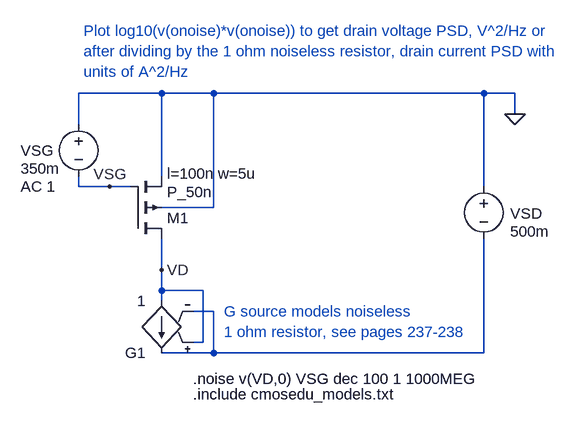
[diagram p0: schematic NOISE_PMOS_50n.asc]
NOISE_PMOS_50n.asc, the LTspice schematic file:
Version 4
SHEET 1 1520 688
WIRE 448 -16 320 -16
WIRE 528 -16 448 -16
WIRE 944 -16 528 -16
WIRE 992 -16 944 -16
WIRE 992 16 992 -16
WIRE 320 32 320 -16
WIRE 448 112 448 -16
WIRE 320 128 320 112
WIRE 368 128 320 128
WIRE 400 128 368 128
WIRE 944 128 944 -16
WIRE 528 160 528 -16
WIRE 528 160 448 160
WIRE 448 256 448 208
WIRE 448 288 448 256
WIRE 512 288 448 288
WIRE 448 304 448 288
WIRE 528 320 496 320
WIRE 512 368 512 288
WIRE 512 368 496 368
WIRE 528 384 528 320
WIRE 528 384 448 384
WIRE 944 384 944 208
WIRE 944 384 528 384
FLAG 992 16 0
FLAG 368 128 VSG
FLAG 448 256 VD
SYMBOL voltage 320 16 R0
WINDOW 0 -89 56 Left 2
WINDOW 3 -89 84 Left 2
WINDOW 123 -89 112 Left 2
WINDOW 39 0 0 Left 2
SYMATTR InstName VSG
SYMATTR Value 350m
SYMATTR Value2 AC 1
SYMBOL voltage 944 112 R0
WINDOW 123 0 0 Left 2
WINDOW 39 0 0 Left 2
WINDOW 0 41 57 Left 2
WINDOW 3 41 85 Left 2
SYMATTR InstName VSD
SYMATTR Value 500m
SYMBOL pmos4 400 208 M180
WINDOW 123 56 100 Left 2
SYMATTR Value2 l=100n w=5u
SYMATTR InstName M1
SYMATTR Value P_50n
SYMBOL g 448 400 R180
SYMATTR InstName G1
SYMATTR Value 1
TEXT 496 424 Left 2 !.noise v(VD,0) VSG dec 100 1 1000MEG
TEXT 496 448 Left 2 !.include cmosedu_models.txt
TEXT 328 -112 Left 2 ;Plot log10(v(onoise)*v(onoise)) to get drain voltage PSD, V^2/Hz or \nafter dividing by the 1 ohm noiseless resistor, drain current PSD with\nunits of A^2/Hz
TEXT 544 320 Left 2 ;G source models noiseless\n1 ohm resistor, see pages 237-238

The netlist it stands for:
* NOISE_PMOS_50n.asc
VSG 0 VSG 350m AC 1
VSD 0 N001 500m
M1 VD VSG 0 0 P_50n l=100n w=5u
G1 VD N001 VD N001 1
.model NMOS NMOS
.model PMOS PMOS
.lib standard.mos
.noise v(VD,0) VSG dec 100 1 1000MEG
.include cmosedu_models.txt
* Plot log10(v(onoise)*v(onoise)) to get drain voltage PSD, V^2/Hz or
* after dividing by the 1 ohm noiseless resistor, drain current PSD with
* units of A^2/Hz
* G source models noiseless
* 1 ohm resistor, see pages 237-238
.backanno
.end